# EAGLE design MD_260w (EAGLE 7.2.0)
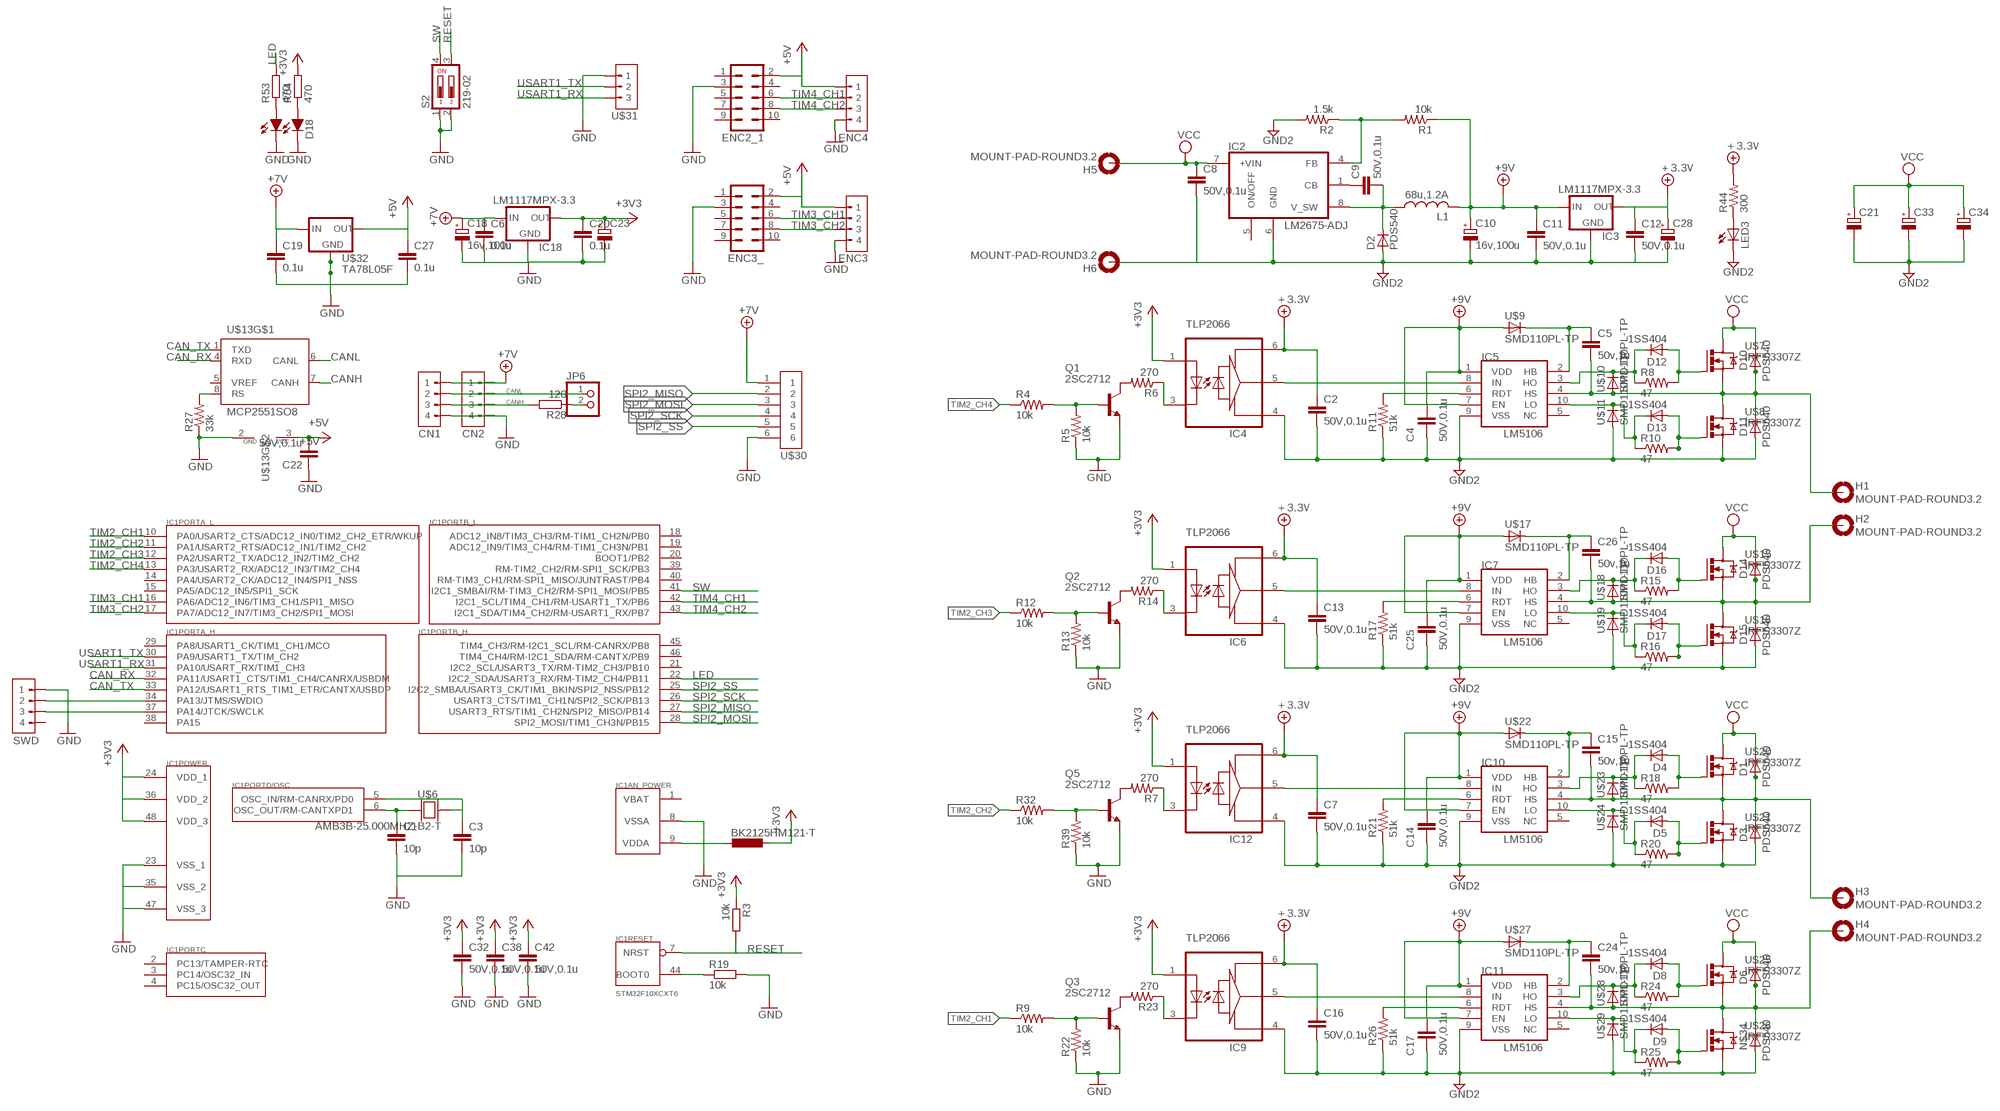
[diagram p0: schematic, sheet 1]

## Parts
BK2125HM121-T  L-EUL2012C  [L2012C]
C1  10p  C-EUC0603  [C0603]
C2  50V,0.1u  C-EUC0603  [C0603]
C3  10p  C-EUC0603  [C0603]
C4  50V,0.1u  C-EUC0603  [C0603]
C5  50v,1u  C-EUC0603  [C0603]
C6  0.1u  C-EUC0603  [C0603]
C7  50V,0.1u  C-EUC0603  [C0603]
C8  50V,0.1u  C-EUC0603  [C0603]
C9  50V,0.1u  C-EUC0603  [C0603]
C10  16v,100u  CPOL-EU153CLV-0605  [153CLV-0605]
C11  50V,0.1u  C-EUC0603  [C0603]
C12  50V,0.1u  C-EUC0603  [C0603]
C13  50V,0.1u  C-EUC0603  [C0603]
C14  50V,0.1u  C-EUC0603  [C0603]
C15  50v,1u  C-EUC0603  [C0603]
C16  50V,0.1u  C-EUC0603  [C0603]
C17  50V,0.1u  C-EUC0603  [C0603]
C18  16v,100u  CPOL-EU153CLV-0605  [153CLV-0605]
C19  0.1u  C-EUC0603  [C0603]
C20  0.1u  C-EUC0603K  [C0603K]
C21  CPOL-EUE7.5-16  [E7,5-16]
C22  50V,0.1u  C-EUC0603  [C0603]
C23  CPOL-EU153CLV-0505  [153CLV-0505]
C24  50v,1u  C-EUC0603  [C0603]
C25  50V,0.1u  C-EUC0603  [C0603]
C26  50v,1u  C-EUC0603  [C0603]
C27  0.1u  C-EUC0603  [C0603]
C28  CPOL-EU153CLV-0505  [153CLV-0505]
C32  50V,0.1u  C-EUC0603K  [C0603K]
C33  CPOL-EUE7.5-16  [E7,5-16]
C34  CPOL-EUE7.5-16  [E7,5-16]
C38  50V,0.1u  C-EUC0603K  [C0603K]
C42  50V,0.1u  C-EUC0603K  [C0603K]
CN1  CN4-JST-XH-TOP  [JST-B4B-XH-A]
CN2  CN4-JST-XH-TOP  [JST-B4B-XH-A]
D1  PDS540  [POWER_DI_5]
D2  PDS540  [POWER_DI_5]
D3  PDS540  [POWER_DI_5]
D4  1SS404  [USC(1.25X2.5)]
D5  1SS404  [USC(1.25X2.5)]
D6  PDS540  [POWER_DI_5]
D8  1SS404  [USC(1.25X2.5)]
D9  1SS404  [USC(1.25X2.5)]
D10  PDS540  [POWER_DI_5]
D11  PDS540  [POWER_DI_5]
D12  1SS404  [USC(1.25X2.5)]
D13  1SS404  [USC(1.25X2.5)]
D14  PDS540  [POWER_DI_5]
D15  PDS540  [POWER_DI_5]
D16  1SS404  [USC(1.25X2.5)]
D17  1SS404  [USC(1.25X2.5)]
D18  SEC2XX4  [LED3025]
ENC2_1  ML10L  [ML10L]
ENC3  CN4-JST-XH-TOP  [JST-B4B-XH-A]
ENC3_  ML10L  [ML10L]
ENC4  CN4-JST-XH-TOP  [JST-B4B-XH-A]
H1  MOUNT-PAD-ROUND3.2  [3,2-PAD]
H2  MOUNT-PAD-ROUND3.2  [3,2-PAD]
H3  MOUNT-PAD-ROUND3.2  [3,2-PAD]
H4  MOUNT-PAD-ROUND3.2  [3,2-PAD]
H5  MOUNT-PAD-ROUND3.2  [3,2-PAD]
H6  MOUNT-PAD-ROUND3.2  [3,2-PAD]
IC1  STM32F10XCXT6  [TQFP48]
IC2  LM2675-ADJ  LM2675  [SOP8-150]
IC3  LM1117MPX-3.3  LM1117  [SOT223]
IC4  TLP2066  TLP117  [MFSOP6]
IC5  LM5106  [MSOP10]
IC6  TLP2066  TLP117  [MFSOP6]
IC7  LM5106  [MSOP10]
IC9  TLP2066  TLP117  [MFSOP6]
IC10  LM5106  [MSOP10]
IC11  LM5106  [MSOP10]
IC12  TLP2066  TLP117  [MFSOP6]
IC18  LM1117MPX-3.3  LM1117  [SOT223]
JP6  PINHD-1X2  [1X02]
L1  68u,1.2A  SLF10145T  [SLF10145]
LED3  0603  [0603]
N$34  PDS540  [POWER_DI_5]
Q1  2SC2712  [SC-59(TYPE1)]
Q2  2SC2712  [SC-59(TYPE1)]
Q3  2SC2712  [SC-59(TYPE1)]
Q5  2SC2712  [SC-59(TYPE1)]
R1  10k  R-US_R0603  [R0603]
R2  1.5k  R-US_R0603  [R0603]
R3  10k  R-EU_R0603  [R0603]
R4  10k  R-US_R0603  [R0603]
R5  10k  R-US_R0603  [R0603]
R6  270  R-US_R0603  [R0603]
R7  270  R-US_R0603  [R0603]
R8  47  R-US_R0603  [R0603]
R9  10k  R-US_R0603  [R0603]
R10  47  R-US_R0603  [R0603]
R11  51k  R-US_R0603  [R0603]
R12  10k  R-US_R0603  [R0603]
R13  10k  R-US_R0603  [R0603]
R14  270  R-US_R0603  [R0603]
R15  47  R-US_R0603  [R0603]
R16  47  R-US_R0603  [R0603]
R17  51k  R-US_R0603  [R0603]
R18  47  R-US_R0603  [R0603]
R19  10k  R-EU_R0603  [R0603]
R20  47  R-US_R0603  [R0603]
R21  51k  R-US_R0603  [R0603]
R22  10k  R-US_R0603  [R0603]
R23  270  R-US_R0603  [R0603]
R24  47  R-US_R0603  [R0603]
R25  47  R-US_R0603  [R0603]
R26  51k  R-US_R0603  [R0603]
R27  33k  R-US_R0603  [R0603]
R28  120  R-EU_R0603  [R0603]
R32  10k  R-US_R0603  [R0603]
R39  10k  R-US_R0603  [R0603]
R44  300  R-US_R0603  [R0603]
R53  470  R-EU_R0603  [R0603]
R54  470  R-EU_R0603  [R0603]
S2  219-02  [CTS-219-02]
SWD  TOP_TYPE_4PIN  [TOP_TYPE_4PIN]
U$6  AMB3B-25.000MHZ-B2-T  [4LCC]
U$7  IRFS3307Z  [IRFS3307Z]
U$8  IRFS3307Z  [IRFS3307Z]
U$9  SMD110PL-TP  [SOD123]
U$10  SMD110PL-TP  [SOD123]
U$11  SMD110PL-TP  [SOD123]
U$13  MCP2551SO8  [SO08]
U$15  IRFS3307Z  [IRFS3307Z]
U$16  IRFS3307Z  [IRFS3307Z]
U$17  SMD110PL-TP  [SOD123]
U$18  SMD110PL-TP  [SOD123]
U$19  SMD110PL-TP  [SOD123]
U$20  IRFS3307Z  [IRFS3307Z]
U$21  IRFS3307Z  [IRFS3307Z]
U$22  SMD110PL-TP  [SOD123]
U$23  SMD110PL-TP  [SOD123]
U$24  SMD110PL-TP  [SOD123]
U$25  IRFS3307Z  [IRFS3307Z]
U$26  IRFS3307Z  [IRFS3307Z]
U$27  SMD110PL-TP  [SOD123]
U$28  SMD110PL-TP  [SOD123]
U$29  SMD110PL-TP  [SOD123]
U$30  CN6  [JST-B6B-XH-A]
U$31  TOP_TYPE_3PIN  [TOP_TYPE_3PIN]
U$32  TA78L05F  [SOT89]

## Nets
+3.3V: C2.1 C7.1 C12.1 C13.1 C16.1 C28.+ IC3.2(OUT1) IC3.4(OUT) IC4.6(VCC) IC6.6(VCC) IC9.6(VCC) IC12.6(VCC) R44.2 ; supply symbol labelled ＋3.3V
+3V3: BK2125HM121-T.1 C20.1 C23.+ C32.1 C38.1 C42.1 IC1.24(POWER:VDD_1) IC1.36(POWER:VDD_2) IC1.48(POWER:VDD_3) IC4.1 IC6.1 IC9.1 IC12.1 IC18.2(OUT1) IC18.4(OUT) R3.1 R54.2
+5V: C22.2 C27.1 ENC2_1.2 ENC3.1 ENC3_.2 ENC4.1 U$13.3(VCC) U$32.1(OUT)
+7V: C6.1 C18.+ C19.1 CN1.1 CN2.1 IC18.3(IN) U$30.1 U$32.3(IN)
+9V: C4.1 C10.+ C11.1 C14.1 C17.1 C25.1 IC3.3(IN) IC5.1(VDD) IC5.7(EN) IC7.1(VDD) IC7.7(EN) IC10.1(VDD) IC10.7(EN) IC11.1(VDD) IC11.7(EN) L1.P$2 R1.1 U$9.A U$17.A U$22.A U$27.A
CAN_RX: IC1.32(PORTA_H:PA11/USART1_CTS/TIM1_CH4/CANRX/USBDM) U$13.4(RXD)
CAN_TX: IC1.33(PORTA_H:PA12/USART1_RTS_TIM1_ETR/CANTX/USBDP) U$13.1(TXD)
CANH: CN1.3 CN2.3 R28.2 U$13.7(CANH)
CANL: CN1.2 CN2.2 JP6.1 U$13.6(CANL)
CLK: IC1.37(PORTA_H:PA14/JTCK/SWCLK) SWD.3
DIO: IC1.34(PORTA_H:PA13/JTMS/SWDIO) SWD.2
GND: C1.2 C3.2 C6.2 C18.- C19.2 C20.2 C22.1 C23.- C27.2 C32.2 C38.2 C42.2 CN1.4 CN2.4 D18.1(C0) D18.2(C1) ENC2_1.3 ENC3.4 ENC3_.3 ENC4.4 IC1.8(AN_POWER:VSSA) IC1.23(POWER:VSS_1) IC1.35(POWER:VSS_2) IC1.47(POWER:VSS_3) IC18.1(GND) Q1.E Q2.E Q3.E Q5.E R5.1 R13.1 R19.2 R22.1 R27.1 R39.1 S2.1 S2.2 SWD.1 U$13.2(GND) U$30.6 U$31.1 U$32.2(GND) U$32.2@1(GND1)
GND2: C2.2 C4.2 C7.2 C8.2 C10.- C11.2 C12.2 C13.2 C14.2 C16.2 C17.2 C21.- C25.2 C28.- C33.- C34.- D2.A1 D2.A2(A) D3.A1 D3.A2(A) D11.A1 D11.A2(A) D15.A1 D15.A2(A) H6.B3,2(MOUNT) IC2.6(GND) IC3.1(GND) IC4.4(GND) IC5.9(VSS) IC6.4(GND) IC7.9(VSS) IC9.4(GND) IC10.9(VSS) IC11.9(VSS) IC12.4(GND) LED3.C N$34.A1 N$34.A2(A) R2.2 R11.1 R17.1 R21.1 R26.1 U$8.3(S) U$11.A U$16.3(S) U$19.A U$21.3(S) U$24.A U$26.3(S) U$29.A
LED: IC1.22(PORTB_H:I2C2_SDA/USART3_RX/RM-TIM2_CH4/PB11) R53.2
N$1: Q3.B R9.2 R22.2
N$2: IC2.4(FB) R1.2 R2.1
N$3: IC12.3 R7.1
N$4: LED3.A R44.1
N$5: BK2125HM121-T.2 IC1.9(AN_POWER:VDDA)
N$6: Q5.C R7.2
N$7: Q3.C R23.2
N$8: IC1.44(RESET:BOOT0) R19.1
N$9: JP6.2 R28.1
N$10: C3.1 IC1.5(PORTD/OSC:OSC_IN/RM-CANRX/PD0) U$6.3
N$11: C1.1 IC1.6(PORTD/OSC:OSC_OUT/RM-CANTXPD1) U$6.1
N$12: IC9.3 R23.1
N$13: IC9.5 IC11.8(IN)
N$14: Q1.B R4.2 R5.2
N$15: Q1.C R6.2
N$16: IC4.3 R6.1
N$17: IC4.5 IC5.8(IN)
N$18: C5.2 D10.A1 D10.A2(A) D11.K(C) H1.B3,2(MOUNT) IC5.4(HS) U$7.3(S) U$8.2(D1) U$10.A
N$19: D12.A R8.2 U$7.1(G1)
N$20: D13.A R10.2 U$8.1(G1)
N$21: D12.K(C) IC5.3(HO) R8.1 U$10.K(C)
N$22: D13.K(C) IC5.10(LO) R10.1 U$11.K(C)
N$23: C5.1 IC5.2(HB) U$9.K(C)
N$24: IC5.6(RDT) R11.2
N$25: Q2.B R12.2 R13.2
N$26: Q2.C R14.2
N$27: IC6.3 R14.1
N$28: IC6.5 IC7.8(IN)
N$29: C26.2 D14.A1 D14.A2(A) D15.K(C) H2.B3,2(MOUNT) IC7.4(HS) U$15.3(S) U$16.2(D1) U$18.A
N$30: C15.2 D1.A1 D1.A2(A) D3.K(C) H3.B3,2(MOUNT) IC10.4(HS) U$20.3(S) U$21.2(D1) U$23.A
N$31: R27.2 U$13.8(RS)
N$32: D16.A R15.2 U$15.1(G1)
N$33: D17.A R16.2 U$16.1(G1)
N$34: C24.2 D6.A1 D6.A2(A) H4.B3,2(MOUNT) IC11.4(HS) N$34.K(C) U$25.3(S) U$26.2(D1) U$28.A
N$35: D16.K(C) IC7.3(HO) R15.1 U$18.K(C)
N$36: D17.K(C) IC7.10(LO) R16.1 U$19.K(C)
N$37: C26.1 IC7.2(HB) U$17.K(C)
N$38: IC10.8(IN) IC12.5
N$39: IC7.6(RDT) R17.2
N$41: D4.A R18.2 U$20.1(G1)
N$42: D5.A R20.2 U$21.1(G1)
N$43: D18.3(A1) R53.1
N$44: D4.K(C) IC10.3(HO) R18.1 U$23.K(C)
N$45: D5.K(C) IC10.10(LO) R20.1 U$24.K(C)
N$46: C15.1 IC10.2(HB) U$22.K(C)
N$47: IC10.6(RDT) R21.2
N$48: D8.A R24.2 U$25.1(G1)
N$49: D9.A R25.2 U$26.1(G1)
N$50: D8.K(C) IC11.3(HO) R24.1 U$28.K(C)
N$51: D9.K(C) IC11.10(LO) R25.1 U$29.K(C)
N$52: C24.1 IC11.2(HB) U$27.K(C)
N$53: IC11.6(RDT) R26.2
N$57: C9.1 IC2.1(CB)
N$58: D18.4(A0) R54.1
N$83: C9.2 D2.K(C) IC2.8(V_SW) L1.P$1
N$119: Q5.B R32.2 R39.2
RESET: IC1.7(RESET:NRST) R3.2 S2.3
SPI2_MISO: IC1.27(PORTB_H:USART3_RTS/TIM1_CH2N/SPI2_MISO/PB14) U$30.2
SPI2_MOSI: IC1.28(PORTB_H:SPI2_MOSI/TIM1_CH3N/PB15) U$30.3
SPI2_SCK: IC1.26(PORTB_H:USART3_CTS/TIM1_CH1N/SPI2_SCK/PB13) U$30.4
SPI2_SS: IC1.25(PORTB_H:I2C2_SMBA/USART3_CK/TIM1_BKIN/SPI2_NSS/PB12) U$30.5
SW: IC1.41(PORTB_L:I2C1_SMBAI/RM-TIM3_CH2/RM-SPI1_MOSI/PB5) S2.4
TIM2_CH1: IC1.10(PORTA_L:PA0/USART2_CTS/ADC12_IN0/TIM2_CH2_ETR/WKUP) R9.1
TIM2_CH2: IC1.11(PORTA_L:PA1/USART2_RTS/ADC12_IN1/TIM2_CH2) R32.1
TIM2_CH3: IC1.12(PORTA_L:PA2/USART2_TX/ADC12_IN2/TIM2_CH2) R12.1
TIM2_CH4: IC1.13(PORTA_L:PA3/USART2_RX/ADC12_IN3/TIM2_CH4) R4.1
TIM3_CH1: ENC3.2 ENC3_.6 IC1.16(PORTA_L:PA6/ADC12_IN6/TIM3_CH1/SPI1_MISO)
TIM3_CH2: ENC3.3 ENC3_.8 IC1.17(PORTA_L:PA7/ADC12_IN7/TIM3_CH2/SPI1_MOSI)
TIM4_CH1: ENC2_1.6 ENC4.2 IC1.42(PORTB_L:I2C1_SCL/TIM4_CH1/RM-USART1_TX/PB6)
TIM4_CH2: ENC2_1.8 ENC4.3 IC1.43(PORTB_L:I2C1_SDA/TIM4_CH2/RM-USART1_RX/PB7)
USART1_RX: IC1.31(PORTA_H:PA10/USART_RX/TIM1_CH3) U$31.3
USART1_TX: IC1.30(PORTA_H:PA9/USART1_TX/TIM_CH2) U$31.2
VCC: C8.1 C21.+ C33.+ C34.+ D1.K(C) D6.K(C) D10.K(C) D14.K(C) H5.B3,2(MOUNT) IC2.7(+VIN) U$7.2(D1) U$15.2(D1) U$20.2(D1) U$25.2(D1)
Unconnected: ENC2_1.1 ENC2_1.4 ENC2_1.5 ENC2_1.7 ENC2_1.9 ENC2_1.10 ENC3_.1 ENC3_.4 ENC3_.5 ENC3_.7 ENC3_.9 ENC3_.10 IC1.2(PORTC:PC13/TAMPER-RTC) IC1.3(PORTC:PC14/OSC32_IN) IC1.4(PORTC:PC15/OSC32_OUT) IC1.14(PORTA_L:PA4/USART2_CK/ADC12_IN4/SPI1_NSS) IC1.15(PORTA_L:PA5/ADC12_IN5/SPI1_SCK) IC1.18(PORTB_L:ADC12_IN8/TIM3_CH3/RM-TIM1_CH2N/PB0) IC1.19(PORTB_L:ADC12_IN9/TIM3_CH4/RM-TIM1_CH3N/PB1) IC1.20(PORTB_L:BOOT1/PB2) IC1.21(PORTB_H:I2C2_SCL/USART3_TX/RM-TIM2_CH3/PB10) IC1.29(PORTA_H:PA8/USART1_CK/TIM1_CH1/MCO) IC1.38(PORTA_H:PA15) IC1.39(PORTB_L:RM-TIM2_CH2/RM-SPI1_SCK/PB3) IC1.40(PORTB_L:RM-TIM3_CH1/RM-SPI1_MISO/JUNTRAST/PB4) IC1.45(PORTB_H:TIM4_CH3/RM-I2C1_SCL/RM-CANRX/PB8) IC1.46(PORTB_H:TIM4_CH4/RM-I2C1_SDA/RM-CANTX/PB9) IC2.5(ON/OFF) IC5.5(NC) IC7.5(NC) IC10.5(NC) IC11.5(NC) SWD.4 U$6.2(G1) U$6.4(G2) U$13.5(VREF)

## Notes on the sheet
- TLP2066
- TLP2066
- TLP2066
- TLP2066

## Power pins joined to a net without a drawn wire
VBAT: IC1.1(AN_POWER:VBAT)

## Library data of the parts
BK2125HM121-T = resistor:L-EU: INDUCTOR, European symbol
C1-C9 C11-C17 C19 C22 C24-C27 = rcl:C-EU: CAPACITOR, European symbol
C10 C18 C21 C23 C28 C33 C34 = rcl:CPOL-EU: POLARIZED CAPACITOR, European symbol
C20 C32 C38 C42 = resistor:C-EU: CAPACITOR, European symbol
CN1 CN2 ENC3 ENC4 = con-jst_xh:CN4: Connector 4 circuits
D1-D3 D6 D10 D11 D14 D15 N$34 = Diode:PDS540
D4 D5 D8 D9 D12 D13 D16 D17 = Diode:1SS404
D18 = SRT162-010:SEC2XX4
ENC2_1 ENC3_ = con-ml:ML10L: HARTING; OC_FARNELL: unknown; OC_NEWARK: unknown
H1-H6 = holes:MOUNT-PAD-ROUND: MOUNTING PAD, round
IC1 = stm32:STM32F10XCXT6: ST STM32F101/103 48pin LQFP
IC2 = SwitchingRegulator:LM2675
IC3 IC18 = VoltageRegulator:LM1117
IC4 IC6 IC9 IC12 = PhotoCoupler:TLP117
IC5 IC7 IC10 IC11 = MotorDriver5x:LM5106
JP6 = pinhead:PINHD-1X2: PIN HEADER
L1 = Inductor:SLF10145T
LED3 = led_0603:0603
Q1-Q3 Q5 = Transistor:2SC2712
R1 R2 R4-R10 R12-R16 R18 R20 R22-R25 R27 R32 R39 R44 = resistor:R-US_: RESISTOR, American symbol
R3 R19 = rcl:R-EU_: RESISTOR, European symbol
R11 R17 R21 R26 = rcl:R-US_: RESISTOR, American symbol
R28 R53 R54 = resistor:R-EU_: RESISTOR, European symbol
S2 = switch-dil:219-02*: Surface Mount DIP Switch Series 219 SMT CTS Electronic Components Sourc: www.ctscorp.com; OC_FARNELL: unknown; OC_NEWARK: unknown
SWD = GHconnector:TOP_TYPE_4PIN
U$6 = stm32f4:AMB3B-25.000MHZ-B2-T: CRYSTAL, 25.000MHZ 18PF SMD reviewed: YES tested: YES
U$7 U$8 U$15 U$16 U$20 U$21 U$25 U$26 = IRFS3307Z:IRFS3307Z
U$9-U$11 U$17-U$19 U$22-U$24 U$27-U$29 = SMD110PL-TP:SMD110PL-TP
U$13 = can:MCP2551: CAN Tranceiver Microchip
U$30 = con-jst_xh:CN6
U$31 = GHconnector:TOP_TYPE_3PIN
U$32 = v-reg:TA78L05F

## Board
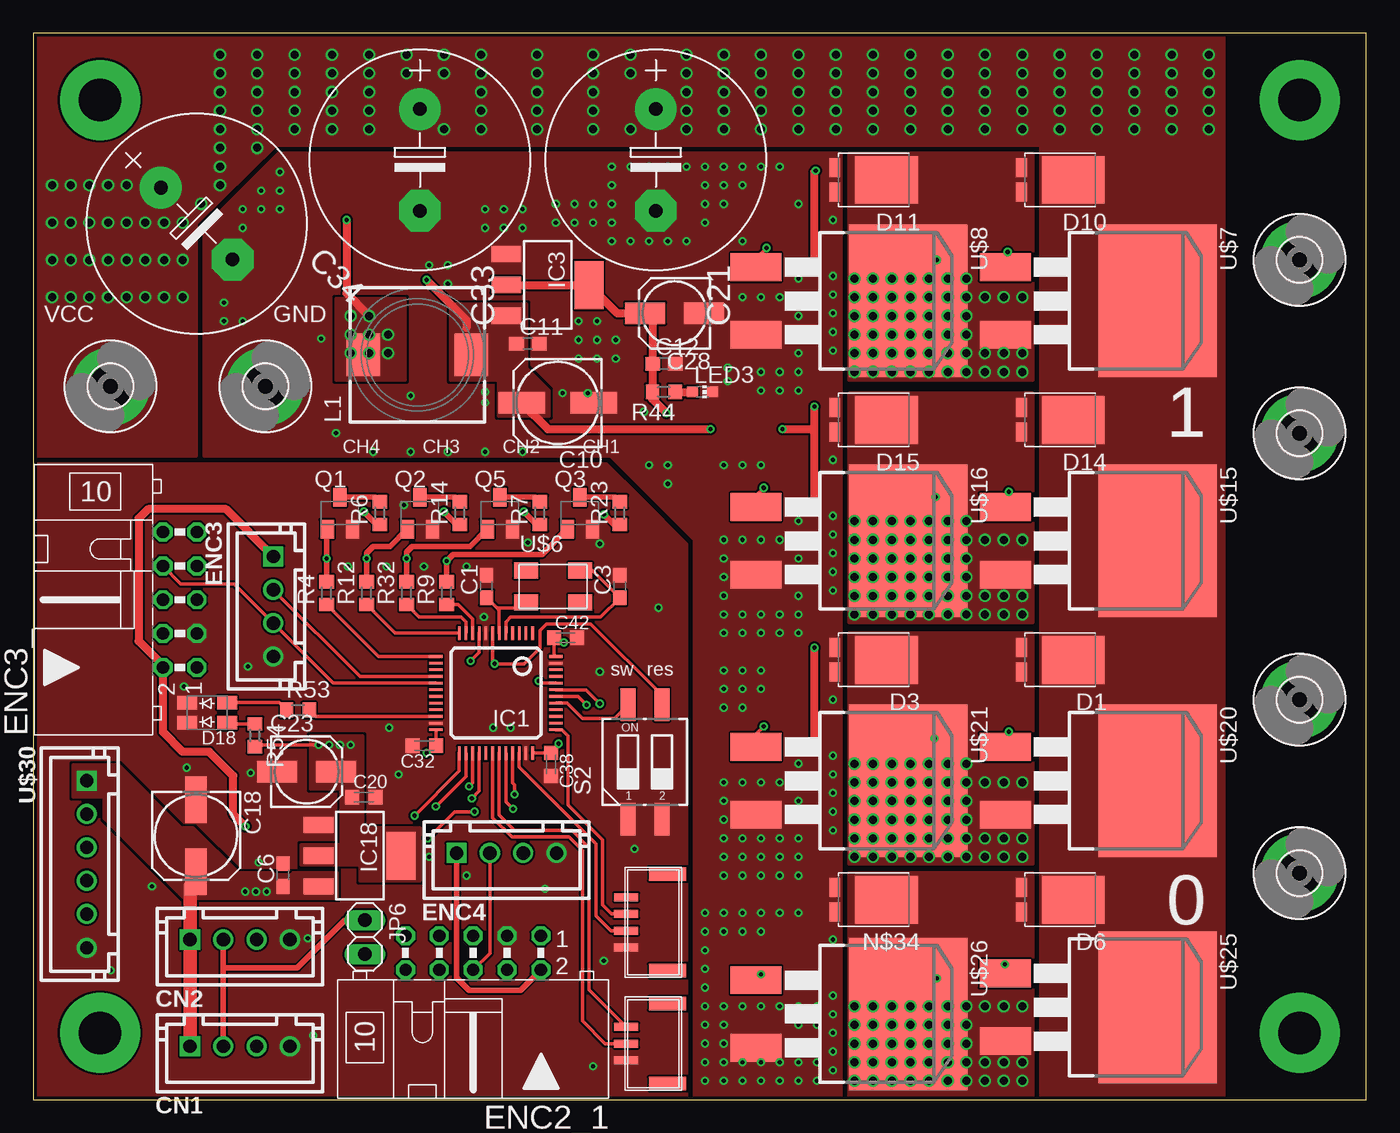
[diagram p1: board, top side]
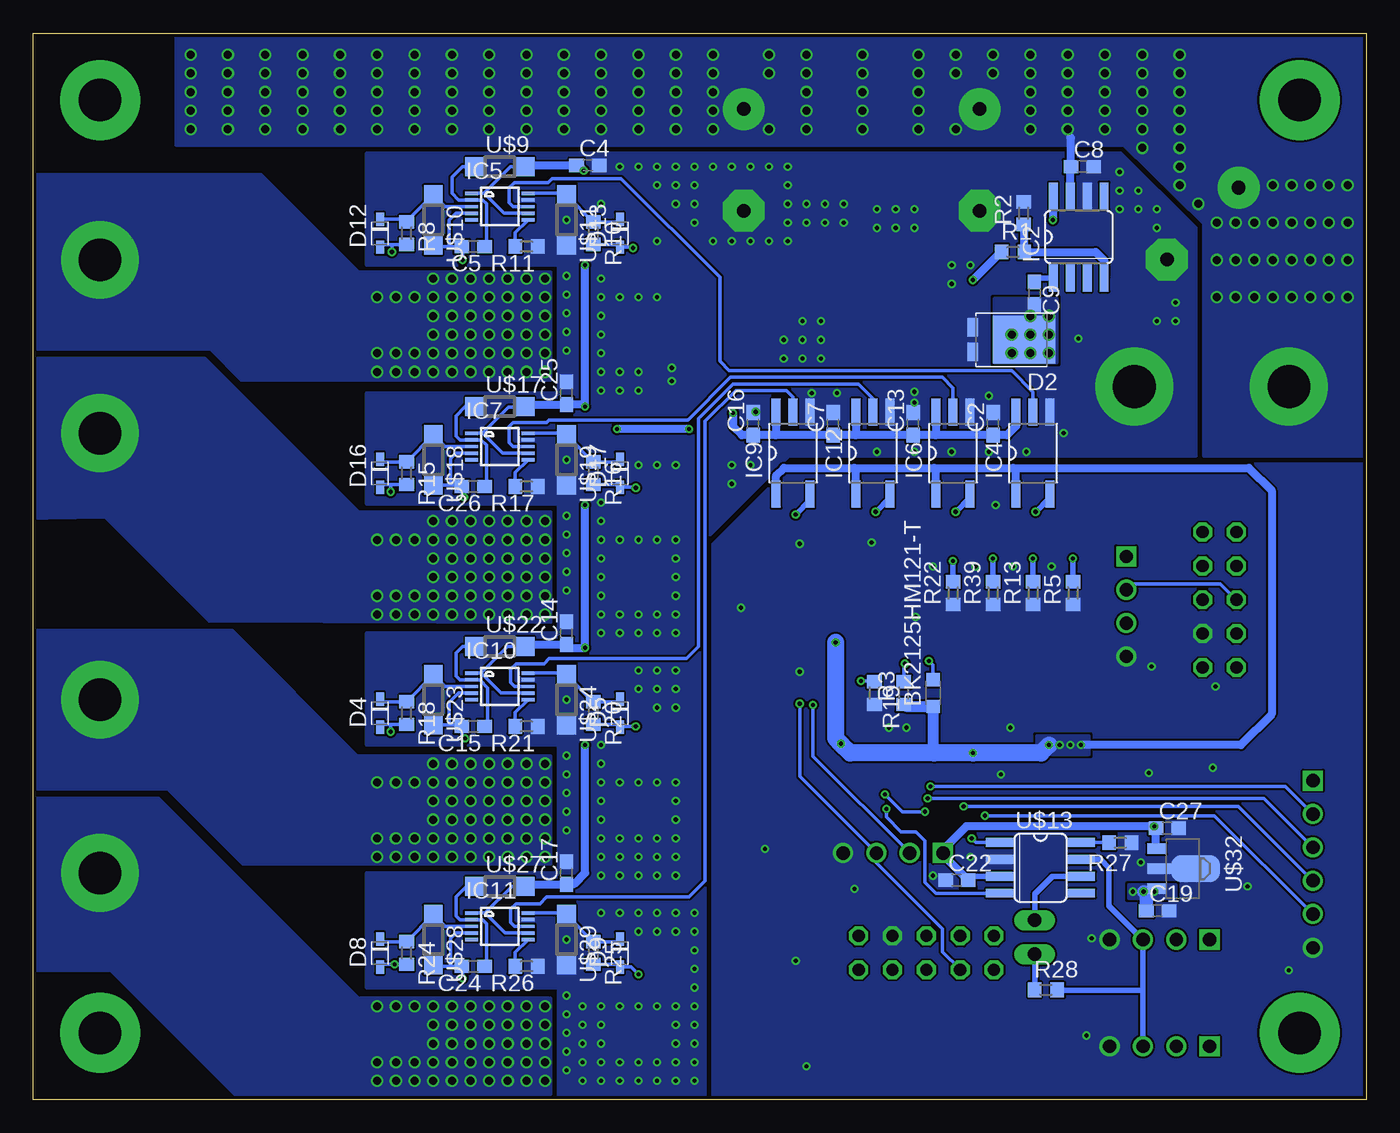
[diagram p2: board, bottom side, seen from below]

Size 100 x 80 mm. Coordinates in mm from the lower left corner, seen from the top.
Outline: 0,0 100,0 100,80 0,80 0,0
Copper layers (1*16): Top 0.035mm / dielectric 1.5mm / Bottom 0.035mm
Design rules "default *": minimum track width 6mil, minimum drill 12mil, track to track 6mil, track to pad 6mil, pad to pad 6mil, via to via 6mil, smd to smd 0mil, copper to edge 10mil, drill to drill 10mil, minimum pad ring 10mil, minimum via ring 6mil, stop-mask expansion 2mil, vias tented up to drill 100mil, thermal gap 10mil

### Footprints (pad centres in the part's own frame; a part is rotated, then mirrored left to right if it is on the bottom)
L2012C = smd 1 x 1: 1 -1,0; 2 1,0
C0603 = smd 1.1 x 1: 1 -0.85,0; 2 0.85,0
153CLV-0605 = smd 3.5 x 1.6: + 2.7,0; - -2.7,0
C0603K = smd 1.05 x 1.08: 1 -0.875,0; 2 0.875,0
E7,5-16 = drill 1.016 pad 3.15: + -3.81,0 | drill 1.016 pad 3.15 octagon: - 3.81,0
153CLV-0505 = smd 3 x 1.6: + 2.2,0; - -2.2,0
JST-B4B-XH-A = drill 1 square: 1 -3.75,0 | drill 1: 2 -1.25,0; 3 1.25,0; 4 3.75,0
POWER_DI_5 = smd 0.8 x 1.4: A1 3.87,0.92; A2 3.87,-0.92 | smd 4.7 x 3.6: K 0,0
USC(1.25X2.5) = smd 1 x 0.6: A -1.05,0; K 1.05,0
LED3025 = smd 1.5 x 1: 1 1.5,0.75; 2 1.5,-0.75; 3 -1.5,-0.75; 4 -1.5,0.75
ML10L = drill 0.914 octagon: 1 -5.08,-1.27; 2 -5.08,1.27; 3 -2.54,-1.27; 4 -2.54,1.27; 5 0,-1.27; 6 0,1.27; 7 2.54,-1.27; 8 2.54,1.27; 9 5.08,-1.27; 10 5.08,1.27
3,2-PAD = drill 3.2 pad 5.842: B3,2 0,0
TQFP48 = smd 0.2 x 1: 1 -2.75,-4.5; 2 -2.25,-4.5; 3 -1.75,-4.5; 4 -1.25,-4.5; 5 -0.75,-4.5; 6 -0.25,-4.5; 7 0.25,-4.5; 8 0.75,-4.5; 9 1.25,-4.5; 10 1.75,-4.5; 11 2.25,-4.5; 12 2.75,-4.5; 25 2.75,4.5; 26 2.25,4.5; 27 1.75,4.5; 28 1.25,4.5; 29 0.75,4.5; 30 0.25,4.5; 31 -0.25,4.5; 32 -0.75,4.5; 33 -1.25,4.5; 34 -1.75,4.5; 35 -2.25,4.5; 36 -2.75,4.5 | smd 1 x 0.2: 13 4.5,-2.75; 14 4.5,-2.25; 15 4.5,-1.75; 16 4.5,-1.25; 17 4.5,-0.75; 18 4.5,-0.25; 19 4.5,0.25; 20 4.5,0.75; 21 4.5,1.25; 22 4.5,1.75; 23 4.5,2.25; 24 4.5,2.75; 37 -4.5,2.75; 38 -4.5,2.25; 39 -4.5,1.75; 40 -4.5,1.25; 41 -4.5,0.75; 42 -4.5,0.25; 43 -4.5,-0.25; 44 -4.5,-0.75; 45 -4.5,-1.25; 46 -4.5,-1.75; 47 -4.5,-2.25; 48 -4.5,-2.75
SOP8-150 = smd 0.66 x 2.032: 1 -1.27,-3.073; 2 0,-3.073; 3 1.27,-3.073; 4 2.54,-3.073; 5 2.54,3.073; 6 1.27,3.073; 7 0,3.073; 8 -1.27,3.073
SOT223 = smd 1.219 x 2.235: 1 -2.311,-3.099; 2 0,-3.099; 3 2.311,-3.099 | smd 3.6 x 2.2: 4 0,3.099
MFSOP6 = smd 0.66 x 2.032: 1 -1.27,-3.073; 3 1.27,-3.073; 4 1.27,3.073; 5 0,3.073; 6 -1.27,3.073
MSOP10 = smd 0.25 x 1: 1 -1,-2.113; 2 -0.5,-2.113; 3 0,-2.113; 4 0.5,-2.113; 5 1,-2.113; 6 1,2.113; 7 0.5,2.113; 8 0,2.113; 9 -0.5,2.113; 10 -1,2.113
1X02 = drill 1.016 long: 1 -1.27,0; 2 1.27,0
SLF10145 = smd 3.2 x 2.5: P$1 0,4.05; P$2 0,-4.05
0603 = smd 0.8 x 0.8: A 0,-0.75; C 0,0.75
SC-59(TYPE1) = smd 1 x 1.4: B -0.95,-1.2; C 0,1.2; E 0.95,-1.2
R0603 = smd 1 x 1.1: 1 -0.85,0; 2 0.85,0
CTS-219-02 = smd 1.13 x 2.44: 1 -1.27,-4.3; 2 1.27,-4.3; 3 1.27,4.3; 4 -1.27,4.3
TOP_TYPE_4PIN = smd 0.6 x 1.8: 1 -1.875,2.025; 2 -0.625,2.025; 3 0.625,2.025; 4 1.875,2.025 | smd 1 x 2.8: P$1 -3.625,-1.075; P$2 3.625,-1.075
4LCC = smd 1.803 x 1.194: 1 -2.032,-1.194; 2 2.032,-1.194; 3 2.032,1.194; 4 -2.032,1.194
IRFS3307Z = smd 2.083 x 3.81: 1 2.54,-5.08; 3 7.62,-5.08 | smd 11.43 x 8.89: 2 5.08,6.35
SOD123 = smd 1.4 x 1.4: A 1.9,0; K -1.9,0
SO08 = smd 0.66 x 2.032: 1 -1.905,-3.073; 2 -0.635,-3.073; 3 0.635,-3.073; 4 1.905,-3.073; 5 1.905,3.073; 6 0.635,3.073; 7 -0.635,3.073; 8 -1.905,3.073
JST-B6B-XH-A = drill 1 square: 1 0.08,0 | drill 1: 2 2.58,0; 3 5.08,0; 4 7.58,0; 5 10.08,0; 6 12.62,0
TOP_TYPE_3PIN = smd 0.6 x 1.8: 1 -1.25,2.025; 2 0,2.025; 3 1.25,2.025 | smd 1 x 2.8: P$4 -3,-1.075; P$5 3,-1.075
SOT89 = smd 0.8 x 1.4: 1 -1.499,-1.981; 3 1.499,-1.981 | smd 0.8 x 1.9: 2 0,-1.727 | smd 2.032 x 3.65: 2@1 0,0.94

### Placement (x,y rotation side)
BK2125HM121-T  32.5,30.5 90 bottom
C1  34,38.5 90 top
C2  28,50.7 90 bottom
C3  44,38.5 90 top
C4  58.4,70.1 0 bottom
C5  67,64 180 bottom
C6  18.74,16.84 90 top
C7  40,50.7 90 bottom
C8  21.3,70 0 bottom
C9  24.89,60.5 270 bottom
C10  39.34,52.27 180 top
C11  37.11,56.71 0 top
C12  47.32,55.21 0 top
C13  34,50.7 90 bottom
C14  60,35 90 bottom
C15  67,28 180 bottom
C16  46,50.7 90 bottom
C17  60,17 90 bottom
C18  12.2,19.8 270 top
C19  15.64,14.16 0 bottom
C20  24.8,22.7 0 top
C21  46.7,70.5 270 top
C22  30.71,16.46 0 bottom
C23  20.5,24.6 0 top
C24  67,10 180 bottom
C25  60,53 90 bottom
C26  67,46 180 bottom
C27  14.92,20.36 0 bottom
C28  48.1,59 180 top
C32  29.33,26.56 180 top
C33  29,70.5 270 top
C34  12.26,65.72 315 top
C38  38.84,25.15 270 top
C42  39.93,34.64 0 top
CN1  15.5,4 0 top
CN2  15.5,12 0 top
D1  78,33 180 top
D2  25.66,57.01 180 bottom
D3  64,33 180 top
D4  74,29 90 bottom
D5  56,29 90 bottom
D6  78,15 180 top
D8  74,11 90 bottom
D9  56,11 90 bottom
D10  78,69 180 top
D11  64,69 180 top
D12  74,65 90 bottom
D13  56,65 90 bottom
D14  78,51 180 top
D15  64,51 180 top
D16  74,47 90 bottom
D17  56,47 90 bottom
D18  13.03,29.03 180 top
ENC2_1  33,11 180 top
ENC3  18,37 270 top
ENC3_  11,37.5 90 top
ENC4  35.5,18.5 0 top
H1  95,63 0 top
H2  95,50 0 top
H3  95,30 0 top
H4  95,17 0 top
H5  5.8,53.5 0 top
H6  17.4,53.5 0 top
IC1  34.7,30.5 180 top
IC2  22.2,64.72 0 bottom
IC3  38.59,61.12 270 top
IC4  25,48.5 0 bottom
IC5  65,67 270 bottom
IC6  31,48.5 0 bottom
IC7  65,49 270 bottom
IC9  43,48.5 0 bottom
IC10  65,31 270 bottom
IC11  65,13 270 bottom
IC12  37,48.5 0 bottom
IC18  24.5,18.3 270 top
JP6  24.87,12.18 270 top
L1  28.82,55.87 90 top
LED3  50.2,53.1 270 top
N$34  64,15 180 top
Q1  23,44 0 top
Q2  29,44 0 top
Q3  41,44 0 top
Q5  35,44 0 top
R1  26.5,63.6 0 bottom
R2  25.7,66.5 90 bottom
R3  34.7,30.5 90 bottom
R4  22,38 90 top
R5  22,38 90 bottom
R6  26,44 90 top
R7  38,44 90 top
R8  72,65 270 bottom
R9  31,38 90 top
R10  58,65 270 bottom
R11  63,64 180 bottom
R12  25,38 90 top
R13  25,38 90 bottom
R14  32,44 90 top
R15  72,47 270 bottom
R16  58,47 270 bottom
R17  63,46 180 bottom
R18  72,29 270 bottom
R19  36.9,30.5 270 bottom
R20  58,29 270 bottom
R21  63,28 180 bottom
R22  31,38 90 bottom
R23  44,44 90 top
R24  72,11 270 bottom
R25  58,11 270 bottom
R26  63,10 180 bottom
R27  18.45,19.27 180 bottom
R28  24.03,8.23 0 bottom
R32  28,38 90 top
R39  28,38 90 bottom
R44  47.3,53.1 180 top
R53  19.85,29.23 0 top
R54  16.63,27.33 270 top
S2  45.89,25.33 0 top
SWD  46.5,13.3 90 top
U$6  39,38.5 0 top
U$7  78,65 270 top
U$8  59.3,65 270 top
U$9  65,70 0 bottom
U$10  70,66 270 bottom
U$11  60,66 270 bottom
U$13  24.43,17.39 270 bottom
U$15  78,47 270 top
U$16  59.3,47 270 top
U$17  65,52 0 bottom
U$18  70,48 270 bottom
U$19  60,48 270 bottom
U$20  78,29 270 top
U$21  59.3,29 270 top
U$22  65,34 0 bottom
U$23  70,30 270 bottom
U$24  60,30 270 bottom
U$25  78,12 270 top
U$26  59.3,11.5 270 top
U$27  65,16 0 bottom
U$28  70,12 270 bottom
U$29  60,12 270 bottom
U$30  4,24 270 top
U$31  46.5,4.2 90 top
U$32  13.74,17.32 270 bottom

### Tracks (layer width: path | path; a pad name or v marks a point on that pad's centre or on a via)
+3.3V  (via drill 0.3)
  Top 0.61: IC3.2 IC3.4 43.81,59 C28.+ 46.47,58.43 C12.1 46.45,55.19 R44.2 46.45,52.55 v47.5,51.5
  Bottom 0.61: 32.3,49.85 C2.1 26.95,49.85 26.27,50.53 IC4.6 | 32.3,49.85 C13.1 38.3,49.85 | 38.3,49.85 C7.1 44.3,49.85 | IC9.6 44.27,49.88 44.3,49.85 | IC12.6 38.27,49.88 38.3,49.85 | IC6.6 32.27,49.88 32.3,49.85 | 44.3,49.85 C16.1 46.85,49.85 47.5,50.5 v47.5,51.5
+3V3  (via drill 0.3)
  Top 0.254: IC1.24 C32.1 29.64,26 v29.5,26 | IC1.36 37.48,26.02 C38.1 39.4,26.59 v39.4,26.7 | IC1.48 39.05,33.4 C42.1 39.4,34.3 v39.8,34.3 | R54.2 16.75,26.6 v21.4,26.6
  Bottom 0.61: IC9.1 44.27,46.83 43.7,47.4 38.4,47.4 | 38.4,47.4 32.4,47.4 | 32.4,47.4 26.5,47.4 | 26.5,47.4 8.8,47.4 7.1,45.7 7.1,28.9 9.4,26.6 v21.4,26.6 | IC12.1 38.27,47.27 38.4,47.4 | IC6.1 32.27,47.27 32.4,47.4 | IC4.1 26.27,47.17 26.5,47.4
  Bottom 0.813: R3.1 34.55,29.5 BK2125HM121-T.1 32.5,26.1 32.4,26
  Bottom 1.27: v23.8,26.6 24.4,26 v29.5,26 32.4,26 38.7,26 v39.4,26.7 39.8,27.1 v39.8,34.3
  other vias: 22.2,26.6 23,26.6
  pour Top (no thermals): 20.8,27.3 24.7,27.3 24.7,20.4 29,20.4 29,16.4 24.5,16.4 24.5,17.6 20.1,17.6 20.1,19.1 23.1,19.1 23.1,23.3 20.8,23.3
  pour Bottom (no thermals): 20.8,27.3 24.7,27.3 24.7,25.9 20.8,25.9
+5V  (via drill 0.3)
  Top 0.406: ENC2_1.2 36.55,8.2 32.7,8.2 31.75,9.15 ENC4.1
  Top 0.61: v15.91,20.5 15,21.41 15,24.3 13.2,26.1 11.2,26.1 9.73,27.57 ENC3_.2 9.73,32.57 7.9,34.4 7.9,43.6 8.6,44.3 14.45,44.3 ENC3.1
  Bottom 0.406: U$13.3 29.57,16.75 C22.2
  Bottom 0.61: U$32.1 15.77,18.87 C27.1 v15.91,20.5 30,20.5 31.75,18.75 ENC4.1 31.75,18.35 C22.2
+7V  (via drill 0.3)
  Top 1.016: CN1.1 CN2.1 11.75,16.05 11.9,16.2
  Bottom 1.016: C19.1 16.49,15.39 v16.7,15.6
  other vias: 15.9,15.6 17.5,15.6
  pour Bottom (no thermals): 14.3,16.1 17.8,16.1 17.8,15.1 14.3,15.1
  pour Top (no thermals): 3,25.1 6.4,25.1 11.1,20.4 12,20.4 15.4,17 22.8,17 22.8,15.1 11.3,15.1 5.3,21.1 5.3,22.7 3,22.7
+9V  (via drill 0.3)
  Top 0.61: C10.+ 38.61,50.3 v50.8,50.3 | v29.5,61.5 32.5,58.5 32.5,57.9 | v56.2,50.3 58.6,50.3 | v58.6,26.6 v58.6,33.9 | v58.6,44.6 58.6,50.3 | 58.6,50.3 v58.6,52 | v58.6,62.6 58.6,69.6 v58.7,69.7
  Bottom 0.254: IC5.7 64.7,66.5 66.2,68 | 66.2,68 IC5.1 | U$9.A 64.2,70 66.2,68 | IC11.7 64.6,12.5 66.1,14 | 66.1,14 IC11.1 | U$27.A 64.1,16 66.1,14 | IC10.7 64.9,30.5 66.4,32 | 66.4,32 IC10.1 | U$22.A 64.4,34 66.4,32 | IC7.7 64.8,48.5 66.3,50 | 66.3,50 IC7.1 | 63.05,51.95 64.35,51.95 66.3,50
  Bottom 0.61: U$17.A 63.05,51.95 62.85,52.15 C25.1 58.75,52.15 v58.6,52 v58.6,62.6 | U$22.A 63.05,33.95 62.85,34.15 C14.1 59.75,33.9 v58.6,33.9 v58.6,44.6 | v50.8,50.3 v56.2,50.3 | R1.1 27.4,63.6 v29.5,61.5 | v58.6,26.6 58.6,17 59.45,16.15 C17.1 62.95,16.15 U$27.A | v58.7,69.7 59.1,70.1 C4.1 63,70.1 U$9.A
  pour Top (no thermals): 31.3,59.7 37,59.7 37,54.9 38.7,53.2 38.7,51.3 34.9,51.3 34.9,54 31.3,54
CAN_RX  (via drill 0.3)
  Top 0.254: IC1.32 35.45,22.35 v36,21.8
  Bottom 0.254: v36,21.8 36,21.2 34.9,20.1 33.8,20.1 33.1,19.4 33.1,16.3 32.28,15.48 U$13.4
CAN_TX  (via drill 0.3)
  Top 0.254: v29.6,19.6 31.6,21.6 v33.1,21.6 | v36.1,22.9 36.1,23.6 35.95,23.75 IC1.33
  Bottom 0.254: U$13.1 29.3,19.3 v29.6,19.6 | v33.1,21.6 34.8,21.6 v36.1,22.9
CANH
  Bottom 0.406: 16.75,8.2 CN2.3 19.3,14.55 19.3,17.4 19.93,18.02 U$13.7 | 16.75,8.2 CN1.3 | R28.2 23.15,8.2 16.75,8.2
CANL
  Top 0.406: CN1.2 14.25,9.9 | 14.25,9.9 CN2.2 | JP6.1 23.35,13.45 19.8,9.9 14.25,9.9
  Bottom 0.406: U$13.6 23.55,16.75 24.87,15.43 JP6.1
CLK
  Top 0.254: SWD.3 43.38,13.93 42.7,14.6 42.7,19.5 40.1,22.1 40.1,27.3 39.65,27.75 IC1.37
DIO
  Top 0.254: IC1.34 36.45,24.95 42.2,19.2 42.2,13.8 43.33,12.68 SWD.2
GND  (via drill 0.3)
  other vias: 23.6,40 26.5,40 29.3,40 33.8,36.2 32.5,40 37.1,41.8 27.8,44.6 42.5,41.7 34.5,27.9 35.8,27.9 46.9,36.9 8.9,16 5.8,9.7 21,4.8 42,2.5 42.8,10.4 45.1,18.8 38.4,15.8 20.6,12.1 16.9,17.8 27.4,24.4 16.3,24.5 11.5,24.9 26.7,27.9 29.7,18.2 42.5,32.1 16.1,32.5 11.3,31 32.5,16.8
  pour Bottom (rank 6, no thermals): -2.9,47.7 43,47.7 49,41.7 49,-4.9 1.4,-4.9 -2.9,-4.9
  pour Top (rank 6, no thermals): -1.2,47.7 43,47.7 45.5,45.2 49,41.7 49,-1.6 -1.2,-1.6
GND2  (via drill 0.3)
  other vias: 28.3,52.8 41.6,53 39.7,53 52.1,54.9 52.1,53.9 54.6,60.2 53.2,60.2 54.6,54.6 54.6,53.2 54.6,42 53.2,42 51.8,42 51.8,40.6 51.8,39.2 51.8,37.8 51.8,36.4 51.8,35 53.2,35 53.2,36.4 54.6,36.4 54.6,35 54.6,23.8 53.2,23.8 51.8,23.8 51.8,22.4 51.8,21 51.8,19.6 51.8,18.2 51.8,16.8 53.2,16.8 53.2,18.2 53.2,19.6 54.6,19.6 54.6,18.2 54.6,16.8 54.6,7 53.2,7 51.8,7 51.8,5.6 51.8,4.2 51.8,2.8 51.8,1.4 53.2,1.4 53.2,2.8 54.6,2.8 54.6,1.4 56,1.4 56,2.8 51.8,32.2 53.2,32.2 54.6,32.2 33.9,53.1 33.9,52.3 51.8,47.6 53.2,47.6 54.6,47.6 47.6,47.6 46.2,47.6 47.6,46.2 51.8,30.8 53.2,30.8 54.6,30.8 53.2,29.4 51.8,29.4 51.8,14 53.2,14 54.6,14 56,14 57.4,14 51.8,12.6 53.2,12.6 54.6,12.6 50.4,14 50.4,12.6 50.4,11.2 50.4,9.8 50.4,7 50.4,8.4 50.4,5.6 50.4,4.2 50.4,2.8 50.4,1.4 57.4,1.4 58.8,1.4 58.8,2.8 57.4,2.8 57.4,4.2 58.8,4.2 58.8,5.6 57.4,5.6 57.4,7 58.8,7 56,7 14.3,58.4 14.3,59.8 15.7,58.4 21.6,57.1 18.5,66.8 18.5,68.2 18.5,69.6 17.1,68.2 17.1,66.8 15.7,66.8 15.7,65.4 33.9,65.4 35.3,65.4 36.7,65.4 36.7,66.8 35.3,66.8 33.9,66.8 31.1,61.2 31.1,62.6 29.7,62.6 22.7,50 25.5,48.6 28.3,48.6 31.1,48.6 33.9,48.6 36.7,48.6 45.8,51.6 43.4,65.8 44.8,64.4 43.4,64.4 60,66 60,48 60,30 60,12 40.9,57 42.3,57 43.7,57 43.7,55.6 42.3,55.6 40.9,55.6 40.9,58.4 42.3,58.4 56,70 57.4,67.2 53.2,64.4 57.4,61.6 57.4,60.2 56,60.2 57.4,58.8 57.4,57.4 57.4,56 60,61.8 60,60.4 60,59 60,57.6 60,56.2 57.4,54.6 56,54.6 56,53.2 57.4,53.2 60,43.8 60,42.4 60,41 60,39.6 60,38.2 56,42 57.4,42 57.4,43.4 57.4,44.8 57.4,40.6 57.4,39.2 57.4,37.8 57.4,36.4 56,36.4 57.4,35 56,35 43.4,67.2 43.4,68.6 43.4,70 44.8,70 47.6,70 46.2,70 49,70 50.4,70 50.4,68.6 50.4,67.2 50.4,65.8 49,64.4 47.6,64.4 46.2,64.4 51.8,70 53.2,70 54.6,70 42,67.2 40.6,67.2 39.2,67.2 39.2,65.8 40.6,65.8 42,65.8 51.8,68.6 53.2,68.6 51.8,67.2 60,25.8 60,24.4 60,23 60,21.6 60,20.2 56,23.8 57.4,23.8 57.4,25.2 57.4,26.6 57.4,22.4 57.4,21 57.4,19.6 57.4,18.2 57.4,16.8 56,16.8 56,18.2 56,19.6 60,7.8 60,6.4 60,5 60,3.6 60,2.2
  pour Bottom (rank 6, no thermals): 49.6,-4.3 49.6,42 43.3,48.3 12.8,48.3 12.8,65.4 18.4,71 75,71 75,62.6 60.6,62.6 60.6,53 75,53 75,44.7 60.6,44.7 60.6,35 75,35 75,26.6 60.6,26.6 60.6,17 75,17 75,8.4 60.6,8.4 60.6,-4.3
  pour Top (rank 6, no thermals): 12.8,48.3 12.8,65.4 18.4,71 60.6,71 60.6,-0.4 60.7,-6 49.6,-6 49.6,42 43.3,48.3
LED
  Top 0.254: IC1.22 21.18,28.75 R53.2
N$1  (via drill 0.3)
  Top 0.406: Q3.B 38.15,40.9 31.5,40.9 v31,40.4 R9.2
  Bottom 0.406: v31,40.4 R9.2
N$2
  Bottom 0.61: R2.1 25.7,63.65 R1.2 20.3,63.6 19.66,62.96 IC2.4
N$3  (via drill 0.3)
  Top 0.406: v36.8,44.1 37.75,43.15 R7.1
  Bottom 0.406: IC12.3 35.73,45.17 v36.8,44.1
N$4
  Top 0.61: R44.1 LED3.A
N$5  (via drill 0.3)
  Top 0.254: IC1.9 33.45,33.55 v32.8,32.9
  Bottom 0.254: v32.8,32.9 32.5,32.6 BK2125HM121-T.2
N$6
  Top 0.406: Q5.C 37.65,45.2 R7.2
N$7
  Top 0.406: Q3.C 43.65,45.2 R23.2
N$8  (via drill 0.3)
  Top 0.254: IC1.44 38.05,31.25 v37.9,31.4
  Bottom 0.254: v37.9,31.4 36.95,31.4 R19.1
N$9
  Bottom 0.406: R28.1 JP6.2
N$10
  Top 0.254: IC1.5 35.45,35.85 35.8,36.2 42.55,36.2 C3.1 41.96,39.69 U$6.3
N$11
  Top 0.254: IC1.6 34.95,36.7 34.77,36.88 | 34.77,36.88 C1.1 | U$6.1 36.54,36.88 34.77,36.88
N$12  (via drill 0.3)
  Top 0.406: v42.8,43.9 43.55,43.15 R23.1
  Bottom 0.406: IC9.3 41.73,44.97 v42.8,43.9
N$13
  Bottom 0.254: IC11.8 63.9,13 64.2,13.3 64.2,14.3 63.8,14.7 62,14.7 61.5,15.2 50.8,15.2 49.6,16.4 49.6,50.9 47.3,53.2 43.5,53.2 43,52.7 IC9.5
N$14  (via drill 0.3)
  Top 0.406: Q1.B 22,42.75 v22,40.6 R4.2
  Bottom 0.406: v22,40.6 R4.2
N$15
  Top 0.406: Q1.C 25.65,45.2 R6.2
N$16  (via drill 0.3)
  Top 0.406: v24.8,44.1 25.75,43.15 R6.1
  Bottom 0.406: IC4.3 23.73,45.17 v24.8,44.1
N$17
  Bottom 0.254: IC5.8 64,67 64.3,67.3 64.3,68.4 63.9,68.8 61.4,68.8 61.1,69.1 55.9,69.1 48.5,61.7 48.5,55.4 47.8,54.7 26.6,54.7 25,53.1 IC4.5
N$18  (via drill 0.3, 0.6)
  Top 0.254: v67.8,63 67.3,63 67.3,62.8
  Bottom 0.254: 68.8,64 C5.2 67.8,64 v67.8,63 | 68.8,64 69.9,64 U$10.A | IC5.4 68.3,66.5 68.8,66 68.8,64
  other vias: 61.6,54.6 61.6,56 61.6,57.4 61.6,58.8 61.6,60.2 61.6,61.6 63,61.6 63,60.2 63,58.8 63,57.4 63,56 63,54.6 64.4,54.6 64.4,56 64.4,57.4 64.4,58.8 64.4,60.2 64.4,61.6 65.8,61.6 65.8,60.2 65.8,58.8 65.8,57.4 65.8,56 65.8,54.6 67.2,54.6 67.2,56 67.2,57.4 67.2,58.8 67.2,60.2 67.2,61.6 68.6,61.6 68.6,60.2 68.6,58.8 68.6,57.4 68.6,56 68.6,54.6 70,54.6 70,56 70,57.4 70,58.8 70,60.2 70,61.6 71.4,60.2 71.4,54.6 72.8,54.6 72.8,60.2 74.2,60.2 74.2,54.6 71.4,56 72.8,56 74.2,56
  pour Top (no thermals): 61.2,71 75,71 75,54 61.2,54
  pour Bottom (no thermals): 61.2,62.1 75.6,62.1 82.9,69.4 101.5,69.4 101.5,56.3 86.7,56.3 84.4,54 61.2,54
N$19  (via drill 0.3)
  Top 0.254: U$7.1 73.1,62.64 v73.1,63.6
  Bottom 0.254: R8.2 73.1,64.15 | 73.1,64.15 73.8,64.15 D12.A | v73.1,63.6 73.1,64.15
N$20  (via drill 0.3)
  Top 0.254: v55,63.9 54.22,63.12 U$8.1
  Bottom 0.254: R10.2 56.2,64.15 D13.A 55.05,63.95 v55,63.9
N$21
  Bottom 0.254: IC5.3 69.1,67 U$10.K 72,65.9 R8.1 72.2,66.05 D12.K
N$22
  Bottom 0.254: IC5.10 60.1,68 U$11.K 60,67.85 R10.1 56.2,65.85 D13.K
N$23
  Bottom 0.254: U$9.K 67.8,70 68.6,69.2 68.6,68 68.1,67.5 IC5.2 66.3,67.5 66,67.2 66,64.15 C5.1
N$24
  Bottom 0.254: IC5.6 63.85,65.04 R11.2
N$25  (via drill 0.3)
  Top 0.406: Q2.B 26.75,41.5 25.5,41.5 25,41 v25,40.6 R12.2
  Bottom 0.406: v25,40.6 R12.2
N$26
  Top 0.406: Q2.C 31.65,45.2 R14.2
N$27  (via drill 0.3)
  Top 0.406: v30.8,44.1 31.75,43.15 R14.1
  Bottom 0.406: IC6.3 29.73,45.17 v30.8,44.1
N$28
  Bottom 0.254: IC7.8 64,49 64.3,49.3 64.3,50.5 64,50.8 61.5,50.8 61.3,51 50.9,51 47.7,54.2 31.8,54.2 31,53.4 IC6.5
N$29  (via drill 0.3, 0.6)
  Top 0.254: v67.7,45.2 67.7,44.4
  Bottom 0.254: 68.7,46.1 67.95,46.1 C26.2 67.85,45.35 v67.7,45.2 | 68.7,46.1 U$18.A | IC7.4 68.3,48.5 68.7,48.1 68.7,46.1
  other vias: 61.6,36.4 61.6,37.8 61.6,39.2 61.6,40.6 61.6,43.4 61.6,42 63,43.4 63,42 63,40.6 63,39.2 63,37.8 63,36.4 64.4,36.4 64.4,37.8 64.4,39.2 64.4,40.6 64.4,42 64.4,43.4 65.8,43.4 65.8,42 65.8,40.6 65.8,39.2 65.8,37.8 65.8,36.4 67.2,36.4 67.2,37.8 67.2,39.2 67.2,40.6 67.2,42 67.2,43.4 68.6,43.4 68.6,42 68.6,40.6 68.6,39.2 68.6,37.8 68.6,36.4 70,36.4 70,37.8 70,39.2 70,40.6 70,42 70,43.4 71.4,42 71.4,36.4 72.8,36.4 72.8,42 74.2,42 74.2,36.4 71.4,37.8 72.8,37.8 74.2,37.8
  pour Top (no thermals): 61.2,53 75,53 75,35.8 61.2,35.8
  pour Bottom (no thermals): 61.2,44.1 75.6,44.1 87.1,55.6 101.1,55.6 101.1,43.6 94.6,43.7 86.8,35.9 61.2,35.8
N$30  (via drill 0.3, 0.6)
  Top 0.254: v67.6,27.1 67,27.1 66.6,26.7
  Bottom 0.254: 68.8,28.1 67.95,28.1 C15.2 67.85,27.35 v67.6,27.1 | 68.8,28.1 U$23.A | IC10.4 68.1,30.5 68.8,29.8 68.8,28.1
  other vias: 61.6,18.2 61.6,25.2 61.6,23.8 61.6,22.4 61.6,21 61.6,19.6 63,25.2 63,23.8 63,22.4 63,21 63,19.6 63,18.2 64.4,18.2 64.4,19.6 64.4,21 64.4,22.4 64.4,23.8 64.4,25.2 65.8,25.2 65.8,23.8 65.8,22.4 65.8,21 65.8,19.6 65.8,18.2 67.2,18.2 67.2,19.6 67.2,21 67.2,22.4 67.2,23.8 67.2,25.2 68.6,25.2 68.6,23.8 68.6,22.4 68.6,21 68.6,19.6 68.6,18.2 70,18.2 70,19.6 70,21 70,22.4 70,23.8 70,25.2 71.4,23.8 72.8,23.8 74.2,23.8 74.2,19.6 72.8,19.6 71.4,19.6 71.4,18.2 72.8,18.2 74.2,18.2
  pour Top (no thermals): 61.2,35 75,35 75,17.7 61.2,17.7
  pour Bottom (no thermals): 61.2,25.8 75.7,25.8 85.1,35.2 101.2,35.2 101.2,23.3 89.9,23.3 84.3,17.7 61.2,17.7
N$31
  Bottom 0.254: R27.2 19.32,19.3 U$13.8
N$32  (via drill 0.3)
  Top 0.254: U$15.1 73.2,44.74 v73.2,45.6
  Bottom 0.254: R15.2 73.2,46.15 | 73.2,46.15 73.8,46.15 D16.A | v73.2,45.6 73.2,46.15
N$33  (via drill 0.3)
  Top 0.254: v54.8,45.9 54.22,45.32 U$16.1
  Bottom 0.254: R16.2 56.2,46.15 D17.A 54.85,45.95 v54.8,45.9
N$34  (via drill 0.3, 0.6)
  Top 0.254: v67.8,9.1 67.9,9 67.9,8.4
  Bottom 0.254: 68.7,10 C24.2 67.8,9.95 v67.8,9.1 | 68.7,10 69.9,10 U$28.A | IC11.4 68.3,12.5 68.7,12.1 68.7,10
  other vias: 61.6,1.4 61.6,2.8 61.6,4.2 61.6,5.6 61.6,7 63,7 63,5.6 63,4.2 63,2.8 63,1.4 64.4,1.4 64.4,2.8 64.4,4.2 64.4,5.6 64.4,7 65.8,7 65.8,5.6 65.8,4.2 65.8,2.8 65.8,1.4 67.2,1.4 67.2,2.8 67.2,4.2 67.2,5.6 67.2,7 68.6,7 68.6,5.6 68.6,4.2 68.6,2.8 68.6,1.4 70,1.4 70,2.8 70,4.2 70,5.6 70,7 71.4,7 72.8,7 74.2,7 74.2,2.8 74.2,1.4 72.8,1.4 72.8,2.8 71.4,2.8 71.4,1.4
  pour Top (no thermals): 61.2,17 75,17 75,0 61.2,0
  pour Bottom (no thermals): 61.2,7.6 75.6,7.6 90.6,22.6 101.4,22.6 101.4,9.7 94.2,9.7 84.9,0.4 61.2,0.4
N$35
  Bottom 0.254: IC7.3 69.1,49 U$18.K 70,49.85 R15.1 73.8,47.85 D16.K
N$36
  Bottom 0.254: IC7.10 60.1,50 U$19.K 60,49.85 R16.1 56.2,47.85 D17.K
N$37
  Bottom 0.254: C26.1 66,46.15 66,49.1 66.4,49.5 IC7.2 68,49.5 68.3,49.8 68.3,51.3 67.6,52 U$17.K
N$38
  Bottom 0.254: IC10.8 63.9,31 64.2,31.3 64.2,32.3 63.8,32.7 61.7,32.7 61.3,33.1 51,33.1 50.1,34 50.1,51.1 47.5,53.7 38.1,53.7 37,52.6 IC12.5
N$39
  Bottom 0.254: IC7.6 63.85,47.04 R17.2
N$40  (via drill 3.2 pad 6)
  other vias: 5,75
N$41  (via drill 0.3)
  Top 0.254: U$20.1 73.2,26.74 v73.2,27.6
  Bottom 0.254: R18.2 73.2,28.15 | 73.2,28.15 73.8,28.15 D4.A | v73.2,27.6 73.2,28.15
N$42  (via drill 0.3)
  Top 0.254: v54.8,28 54.22,27.42 U$21.1
  Bottom 0.254: R20.2 56.2,28.15 D5.A 55.95,28 v54.8,28
N$43
  Top 0.254: R53.1 18.45,29.78 D18.3
N$44
  Bottom 0.254: IC10.3 69.1,31 U$23.K 70,31.85 R18.1 73.8,29.85 D4.K
N$45
  Bottom 0.254: IC10.10 60.1,32 U$24.K 60,31.85 R20.1 56.2,29.85 D5.K
N$46
  Bottom 0.254: C15.1 65.9,28.25 65.9,30.9 66.5,31.5 IC10.2 68,31.5 68.3,31.8 68.3,33.5 67.8,34 U$22.K
N$47
  Bottom 0.254: IC10.6 63.85,29.04 R21.2
N$48  (via drill 0.3)
  Top 0.254: U$25.1 72.92,10.13 v72.9,10.15
  Bottom 0.254: D8.A 73.8,10.15 v72.9,10.15 R24.2
N$49  (via drill 0.3)
  Top 0.254: v54.6,9.4 54.6,9.34 U$26.1
  Bottom 0.254: R25.2 56.2,10.15 D9.A 55.15,9.95 v54.6,9.4
N$50
  Bottom 0.254: IC11.3 69.1,13 U$28.K 70,13.85 R24.1 73.8,11.85 D8.K
N$51
  Bottom 0.254: IC11.10 60.1,14 U$29.K 60,13.85 R25.1 56.2,11.85 D9.K
N$52
  Bottom 0.254: C24.1 66,10.15 66,13.2 66.3,13.5 IC11.2 68,13.5 68.3,13.8 68.3,15.2 67.5,16 U$27.K
N$53
  Bottom 0.254: IC11.6 63.85,11.04 R26.2
N$54  (via drill 3.2 pad 6)
  other vias: 5,5
N$55  (via drill 3.2 pad 6)
  other vias: 95,5
N$56  (via drill 3.2 pad 6)
  other vias: 95,75
N$57
  Bottom 0.406: IC2.1 24.59,61.65 C9.1
N$58
  Top 0.254: D18.4 14.63,28.18 R54.1
N$83  (via drill 0.3, 0.6)
  Top 0.61: v23.5,66 23.5,60.5 v25.2,58.8
  Bottom 0.61: IC2.8 23.5,67.76 v23.5,66
  other vias: 23.8,58.8 26.6,57.4 25.2,57.4 23.8,57.4 23.8,56 25.2,56 26.6,56
  pour Top (no thermals): 23.4,58.8 26.2,58.8 26.2,54.2 23.4,54.2
  pour Bottom (no thermals): 23.2,60.1 27.9,60.1 27.9,55.3 23.2,55.3
  pour Top (no thermals): 22.7,60.1 27.9,60.1 27.9,54 22.7,54
N$119  (via drill 0.3)
  Top 0.406: Q5.B 32.75,41.5 28.4,41.5 28,41.1 v28,40.6 R32.2
  Bottom 0.406: v28,40.6 R32.2
RESET  (via drill 0.3)
  Top 0.254: IC1.7 34.45,32.85 v34.6,32.7 36.8,32.7 38,33.9 38,35.2 38.5,35.7 41.8,35.7 47.16,30.34 S2.3
  Bottom 0.254: v34.6,32.7 34.7,32.6 R3.2
SPI2_MISO  (via drill 0.3)
  Top 0.254: IC1.27 32.95,23.75 v32.7,23.5
  Bottom 0.254: v32.7,23.5 6.08,23.5 U$30.2
SPI2_MOSI  (via drill 0.3)
  Top 0.254: IC1.28 33.45,23.15 v32.9,22.6
  Bottom 0.254: v32.9,22.6 7.68,22.6 U$30.3
SPI2_SCK  (via drill 0.3)
  Top 0.254: IC1.26 32.45,24.25 v30.2,22
  Bottom 0.254: U$30.4 9.58,22 v30.2,22
SPI2_SS  (via drill 0.3)
  Top 0.254: IC1.25 31.95,24.65 v28.6,21.3
  Bottom 0.254: U$30.5 11.38,21.3 v28.6,21.3
SW
  Top 0.254: IC1.41 40.05,29.75 41.2,28.6 43.59,28.6 S2.4
TIM2_CH1
  Top 0.254: IC1.10 32.95,36.05 31.85,37.15 R9.1
TIM2_CH2
  Top 0.254: IC1.11 32.45,35.85 32.1,36.2 28.95,36.2 R32.1
TIM2_CH3
  Top 0.254: IC1.12 27.15,35 R12.1
TIM2_CH4
  Top 0.254: IC1.13 25.9,33.25 R4.1
TIM3_CH1
  Top 0.254: IC1.16 24.5,31.75 ENC3.2
  Bottom 0.254: ENC3_.6 10.93,38.7 17.55,38.7 ENC3.2
TIM3_CH2
  Top 0.254: IC1.17 22.5,31.25 ENC3.3 15.05,38.7 11.07,38.7 ENC3_.8
TIM4_CH1  (via drill 0.3)
  Top 0.254: ENC4.2 34.25,10.98 ENC2_1.6 | IC1.42 40.85,30.25 v41.5,29.6
  Bottom 0.254: v41.5,29.6 41.5,25.75 ENC4.2
TIM4_CH2  (via drill 0.3)
  Top 0.254: IC1.43 41.45,30.75 v42.5,29.7
  Bottom 0.254: ENC2_1.8 30.46,9.76 31.8,11.1 31.8,12.8 36.75,17.75 ENC4.3 42.5,24.25 v42.5,29.7
USART1_RX
  Top 0.254: IC1.31 34.95,21.35 36.1,20.2 40.4,20.2 41.7,18.9 41.7,8.22 U$31.3
USART1_TX
  Top 0.254: IC1.30 34.45,21.15 35.9,19.7 40.2,19.7 41.2,18.7 41.2,5.9 42.9,4.2 U$31.2
VCC  (via drill 0.6)
  Bottom 0.61: IC2.7 22.2,69.95 C8.1 22.15,72.15 22.2,72.2
  other vias: 1.4,63 2.8,63 4.2,63 5.6,63 7,63 8.4,63 9.8,63 11.2,63 14,78.4 14,77 14,75.6 14,74.2 14,72.8 14,71.4 14,70 14,68.6 37.8,78.4 37.8,77 37.8,75.6 37.8,74.2 37.8,72.8 51.8,78.4 51.8,77 51.8,75.6 51.8,74.2 1.4,60.2 2.8,60.2 4.2,60.2 5.6,60.2 7,60.2 8.4,60.2 9.8,60.2 11.2,60.2 1.4,65.8 2.8,65.8 5.6,65.8 4.2,65.8 7,65.8 8.4,65.8 9.8,65.8 11.2,65.8 12.6,67.2 1.4,68.6 2.8,68.6 4.2,68.6 5.6,68.6 7,68.6 16.8,78.4 16.8,77 16.8,75.6 16.8,74.2 16.8,72.8 16.8,71.4 19.6,78.4 19.6,77 19.6,75.6 19.6,74.2 19.6,72.8 22.4,78.4 22.4,77 22.4,75.6 22.4,74.2 22.4,72.8 25.2,78.4 25.2,77 25.2,75.6 25.2,74.2 25.2,72.8 28,78.4 28,77 30.8,78.4 30.8,77 33.6,78.4 33.6,77 33.6,75.6 33.6,74.2 33.6,72.8 30.8,72.8 42,78.4 42,77 42,75.6 42,74.2 42,72.8 44.8,78.4 44.8,77 44.8,72.8 49,78.4 49,77 49,75.6 49,74.2 49,72.8 51.8,72.8 54.6,78.4 54.6,77 54.6,75.6 54.6,74.2 54.6,72.8 57.4,78.4 57.4,77 57.4,75.6 57.4,74.2 57.4,72.8 60.2,78.4 60.2,77 60.2,75.6 60.2,74.2 60.2,72.8 63,78.4 63,77 63,75.6 63,74.2 63,72.8 65.8,78.4 65.8,77 65.8,75.6 65.8,74.2 65.8,72.8 68.6,78.4 68.6,77 68.6,75.6 68.6,74.2 68.6,72.8 71.4,78.4 71.4,77 71.4,75.6 71.4,74.2 71.4,72.8 74.2,78.4 74.2,77 74.2,75.6 74.2,74.2 74.2,72.8 77,78.4 77,77 77,75.6 77,74.2 77,72.8 79.8,78.4 79.8,77 79.8,75.6 79.8,74.2 79.8,72.8 82.6,78.4 82.6,77 82.6,75.6 82.6,74.2 82.6,72.8 85.4,78.4 85.4,77 85.4,75.6 85.4,74.2 85.4,72.8 88.2,78.4 88.2,77 88.2,75.6 88.2,74.2 88.2,72.8
  pour Top (no thermals): -1.9,82.8 89.3,82.8 89.3,-1.8 75.6,-1.8 75.6,71.6 18.2,71.6 12.2,65.7 12.2,48.3 -1.9,48.3
  pour Bottom (no thermals): -1.8,81.6 89.3,81.6 89.3,71.6 18.2,71.6 12.2,65.7 12.2,48.3 -1.8,48.3

### Text on the board
tPlace: VCC | GND | 1 | CH4 | CH3 | CH2 | CH1 | sw | res | 0